# Altium schematic sheet biointerfaceController_pcb_Sens.SchDoc
size 420 x 297 mm; Author: Гаврилов С.А; Engineer: Инженер; Address1: Address1; Address2: Address2; Address3: Address3; Address4: Address4; DocumentNumber: АБВГ.123456.001 Э3; SheetNumber: 2; SheetTotal: 3; Scale: 1:1; EngineerName: Гаврилов С.А.; DocumentType: Схема электрическая принципиальная; Mass: -; FirstReferrence: АБВГ.123456.001
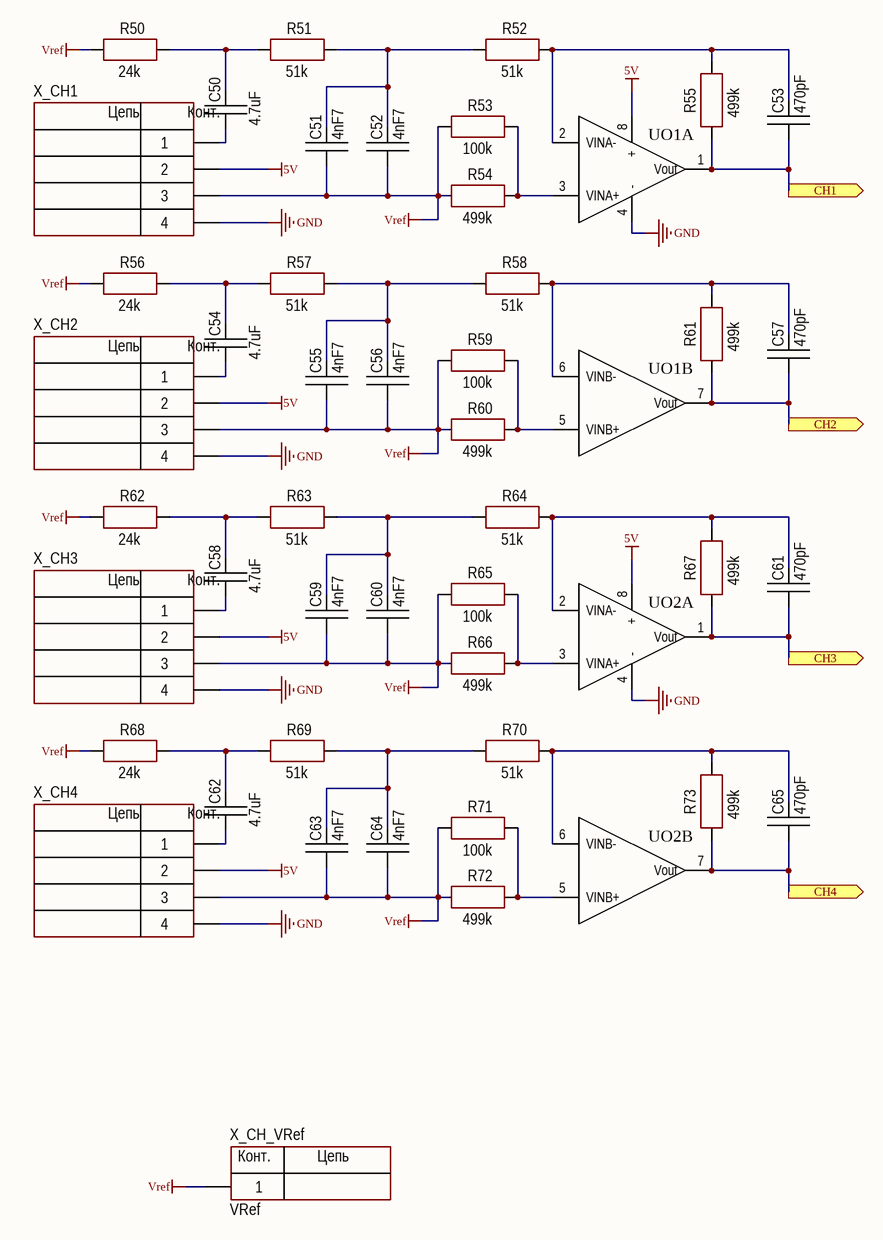
[diagram p0: biointerfaceController_pcb_Sens.SchDoc]

## Parts
C50  4.7uF  [SMD-1206C]
C51  4nF7  [CH0402C]
C52  4nF7  [CH0402C]
C53  470pF  [CH0402C]
C54  4.7uF  [SMD-1206C]
C55  4nF7  [CH0402C]
C56  4nF7  [CH0402C]
C57  470pF  [CH0402C]
C58  4.7uF  [SMD-1206C]
C59  4nF7  [CH0402C]
C60  4nF7  [CH0402C]
C61  470pF  [CH0402C]
C62  4.7uF  [SMD-1206C]
C63  4nF7  [CH0402C]
C64  4nF7  [CH0402C]
C65  470pF  [CH0402C]
R50  24k  [CH0402R]
R51  51k  [CH0402R]
R52  51k  [CH0402R]
R53  100k  [CH0402R]
R54  499k  [CH0402R]
R55  499k  [CH0402R]
R56  24k  [CH0402R]
R57  51k  [CH0402R]
R58  51k  [CH0402R]
R59  100k  [CH0402R]
R60  499k  [CH0402R]
R61  499k  [CH0402R]
R62  24k  [CH0402R]
R63  51k  [CH0402R]
R64  51k  [CH0402R]
R65  100k  [CH0402R]
R66  499k  [CH0402R]
R67  499k  [CH0402R]
R68  24k  [CH0402R]
R69  51k  [CH0402R]
R70  51k  [CH0402R]
R71  100k  [CH0402R]
R72  499k  [CH0402R]
R73  499k  [CH0402R]
UO1  MCP6L02T-E/MS  [SOP65P490X110-8N]  (value not drawn)  (parts A,B of 2)
UO2  MCP6L02T-E/MS  [SOP65P490X110-8N]  (value not drawn)  (parts A,B of 2)
X_CH1  *  [JSTIC_Molex_125]  (value not drawn)
X_CH2  *  [JSTIC_Molex_125]  (value not drawn)
X_CH3  *  [JSTIC_Molex_125]  (value not drawn)
X_CH4  *  [JSTIC_Molex_125]  (value not drawn)
X_CH_VRef  VRef  [CON: PADS 1x1mm]

## Ports
CH1 (out), CH2 (out), CH3 (out), CH4 (out)

## Nets
5V: UO1.8(+) UO2.8(+) X_CH1.2 X_CH2.2 X_CH3.2 X_CH4.2
GND: UO1.4(-) UO2.4(-) X_CH1.4 X_CH2.4 X_CH3.4 X_CH4.4
Vref: C51.1 C52.1 C55.1 C56.1 C59.1 C60.1 C63.1 C64.1 R50.1 R53.1 R54.1 R56.1 R59.1 R60.1 R62.1 R65.1 R66.1 R68.1 R71.1 R72.1 X_CH1.3 X_CH2.3 X_CH3.3 X_CH4.3 X_CH_VRef.1
CH1: C53.1 R55.1 UO1.1(Vout) ; port CH1
CH2: C57.1 R61.1 UO1.7(Vout) ; port CH2
CH3: C61.1 R67.1 UO2.1(Vout) ; port CH3
CH4: C65.1 R73.1 UO2.7(Vout) ; port CH4
NetC50_1: C50.1 X_CH1.1
NetC50_2: C50.2 R50.2 R51.1
NetC51_2: C51.2 C52.2 R51.2 R52.1
NetC53_2: C53.2 R52.2 R55.2 UO1.2(VINA-)
NetC54_1: C54.1 X_CH2.1
NetC54_2: C54.2 R56.2 R57.1
NetC55_2: C55.2 C56.2 R57.2 R58.1
NetC57_2: C57.2 R58.2 R61.2 UO1.6(VINB-)
NetC58_1: C58.1 X_CH3.1
NetC58_2: C58.2 R62.2 R63.1
NetC59_2: C59.2 C60.2 R63.2 R64.1
NetC61_2: C61.2 R64.2 R67.2 UO2.2(VINA-)
NetC62_1: C62.1 X_CH4.1
NetC62_2: C62.2 R68.2 R69.1
NetC63_2: C63.2 C64.2 R69.2 R70.1
NetC65_2: C65.2 R70.2 R73.2 UO2.6(VINB-)
NetR53_2: R53.2 R54.2 UO1.3(VINA+)
NetR59_2: R59.2 R60.2 UO1.5(VINB+)
NetR65_2: R65.2 R66.2 UO2.3(VINA+)
NetR71_2: R71.2 R72.2 UO2.5(VINB+)

## Notes on the sheet
- Перв. примен.
- Справ. №
- Подп. и дата
- Инв. № дубл.
- Взам. инв. №
- Разраб.
- Изм.
- Лист
- № докум.
- Подп.
- Дата
- Лит.
- Масса
- Масштаб
- Пров.
- Т.контр.
- Листов
- Инв. № подл.
- Утв.
- Н.контр.
- 2.106-A3
- Копировал
- Формат А3
- (in symbol 1-Connector) Конт.; Цепь
- (in symbol Connector-4) Цепь; Конт.

## Library data of the parts
C50-C65 = Capacitor: Manufacturer: *; Model: *; HelpURL: *; ComponentKind: *
  C50 C54 C58 C62: Value: 4.7uF
  C51 C52 C55 C56 C59 C60 C63 C64: Value: 4nF7
  C53 C57 C61 C65: Value: 470pF
R50-R73 = Resistor: Manufacturer: *; Model: *; HelpURL: *; ComponentKind: *
  R50 R56 R62 R68: Value: 24k
  R51 R52 R57 R58 R63 R64 R69 R70: Value: 51k
  R53 R59 R65 R71: Value: 100k
  R54 R55 R60 R61 R66 R67 R72 R73: Value: 499k
UO1 UO2 = MCP6L02T-E/MS: Vendor: Microchip; Built_By: EMA_UL_Team; Manufacturer_Part_Number: MCP6L02T-E/MS; Copyright: Copyright (C) 2018 Accelerated Designs. All rights reserved; RefDes: RefDes; Type: DEV; Value: Value
X_CH1-X_CH4 = Connector-4: Model: *; Manufacturer: *; HelpURL: *; ComponentKind: *
X_CH_VRef = 1-Connector: Model: *; Manufacturer: *; HelpURL: *; ComponentKind: *